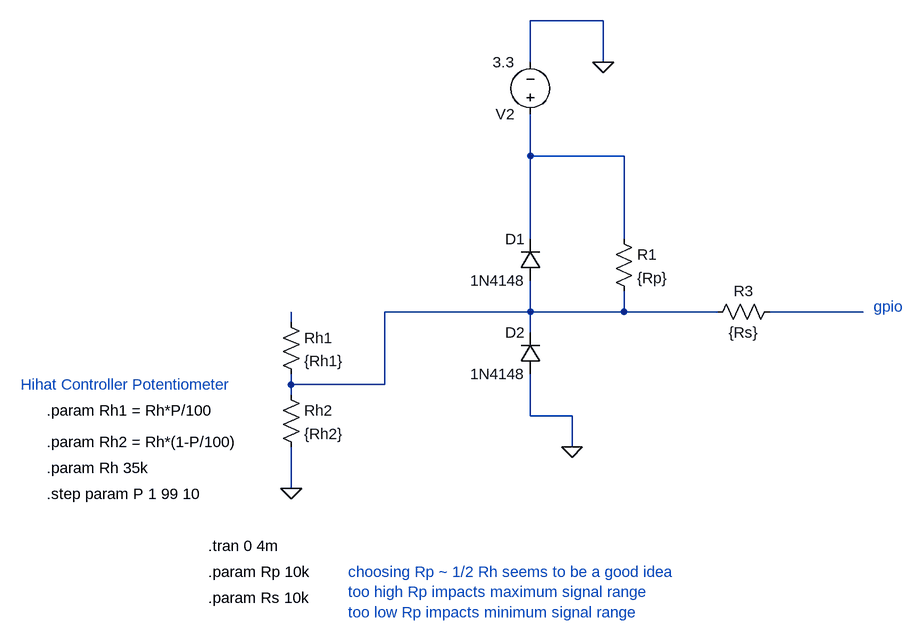
[diagram p0: schematic edrumulus_hihat.asc]
edrumulus_hihat.asc, the LTspice schematic file:
Version 4
SHEET 1 880 680
WIRE 288 -336 176 -336
WIRE 176 -272 176 -336
WIRE 288 -272 288 -336
WIRE 176 -128 176 -192
WIRE 320 -128 176 -128
WIRE 176 0 176 -128
WIRE 320 0 320 -128
WIRE 176 112 176 64
WIRE 176 112 -48 112
WIRE 320 112 320 80
WIRE 320 112 176 112
WIRE 464 112 320 112
WIRE 688 112 544 112
WIRE -192 128 -192 112
WIRE 176 144 176 112
WIRE -192 224 -192 208
WIRE -48 224 -48 112
WIRE -48 224 -192 224
WIRE -192 240 -192 224
WIRE 176 272 176 208
WIRE 240 272 176 272
WIRE 240 320 240 272
WIRE -192 384 -192 320
FLAG -192 384 0
FLAG 288 -272 0
FLAG 240 320 0
SYMBOL diode 192 64 R180
WINDOW 0 24 64 Left 2
WINDOW 3 24 0 Left 2
SYMATTR InstName D1
SYMATTR Value 1N4148
SYMBOL diode 192 208 R180
WINDOW 0 24 64 Left 2
WINDOW 3 24 0 Left 2
SYMATTR InstName D2
SYMATTR Value 1N4148
SYMBOL res 304 -16 R0
SYMATTR InstName R1
SYMATTR Value {Rp}
SYMBOL voltage 176 -176 R180
WINDOW 123 0 0 Left 0
WINDOW 39 0 0 Left 0
SYMATTR InstName V2
SYMATTR Value 3.3
SYMBOL res 560 96 R90
WINDOW 0 0 56 VBottom 2
WINDOW 3 32 56 VTop 2
SYMATTR InstName R3
SYMATTR Value {Rs}
SYMBOL res -208 112 R0
SYMATTR InstName Rh1
SYMATTR Value {Rh1}
SYMBOL res -208 224 R0
SYMATTR InstName Rh2
SYMATTR Value {Rh2}
TEXT 704 104 Left 2 ;gpio
TEXT -320 472 Left 2 !.tran 0 4m
TEXT -320 512 Left 2 !.param Rp 10k
TEXT -320 552 Left 2 !.param Rs 10k
TEXT -608 224 Left 2 ;Hihat Controller Potentiometer
TEXT -568 264 Left 2 !.param Rh1 = Rh*P/100
TEXT -568 312 Left 2 !.param Rh2 = Rh*(1-P/100)
TEXT -568 352 Left 2 !.param Rh 35k
TEXT -568 392 Left 2 !.step param P 1 99 10
TEXT -104 512 Left 2 ;choosing Rp ~ 1/2 Rh seems to be a good idea\ntoo high Rp impacts maximum signal range\ntoo low Rp impacts minimum signal range

The netlist it stands for:
* edrumulus_hihat.asc
D1 N002 N001 1N4148
D2 0 N002 1N4148
R1 N001 N002 {Rp}
V2 N001 0 3.3
R3 N003 N002 {Rs}
Rh1 N004 N002 {Rh1}
Rh2 N002 0 {Rh2}
.model D D
.lib standard.dio
* gpio
.tran 0 4m
.param Rp 10k
.param Rs 10k
* Hihat Controller Potentiometer
.param Rh1 = Rh*P/100
.param Rh2 = Rh*(1-P/100)
.param Rh 35k
.step param P 1 99 10
* choosing Rp ~ 1/2 Rh seems to be a good idea
* too high Rp impacts maximum signal range
* too low Rp impacts minimum signal range
.backanno
.end